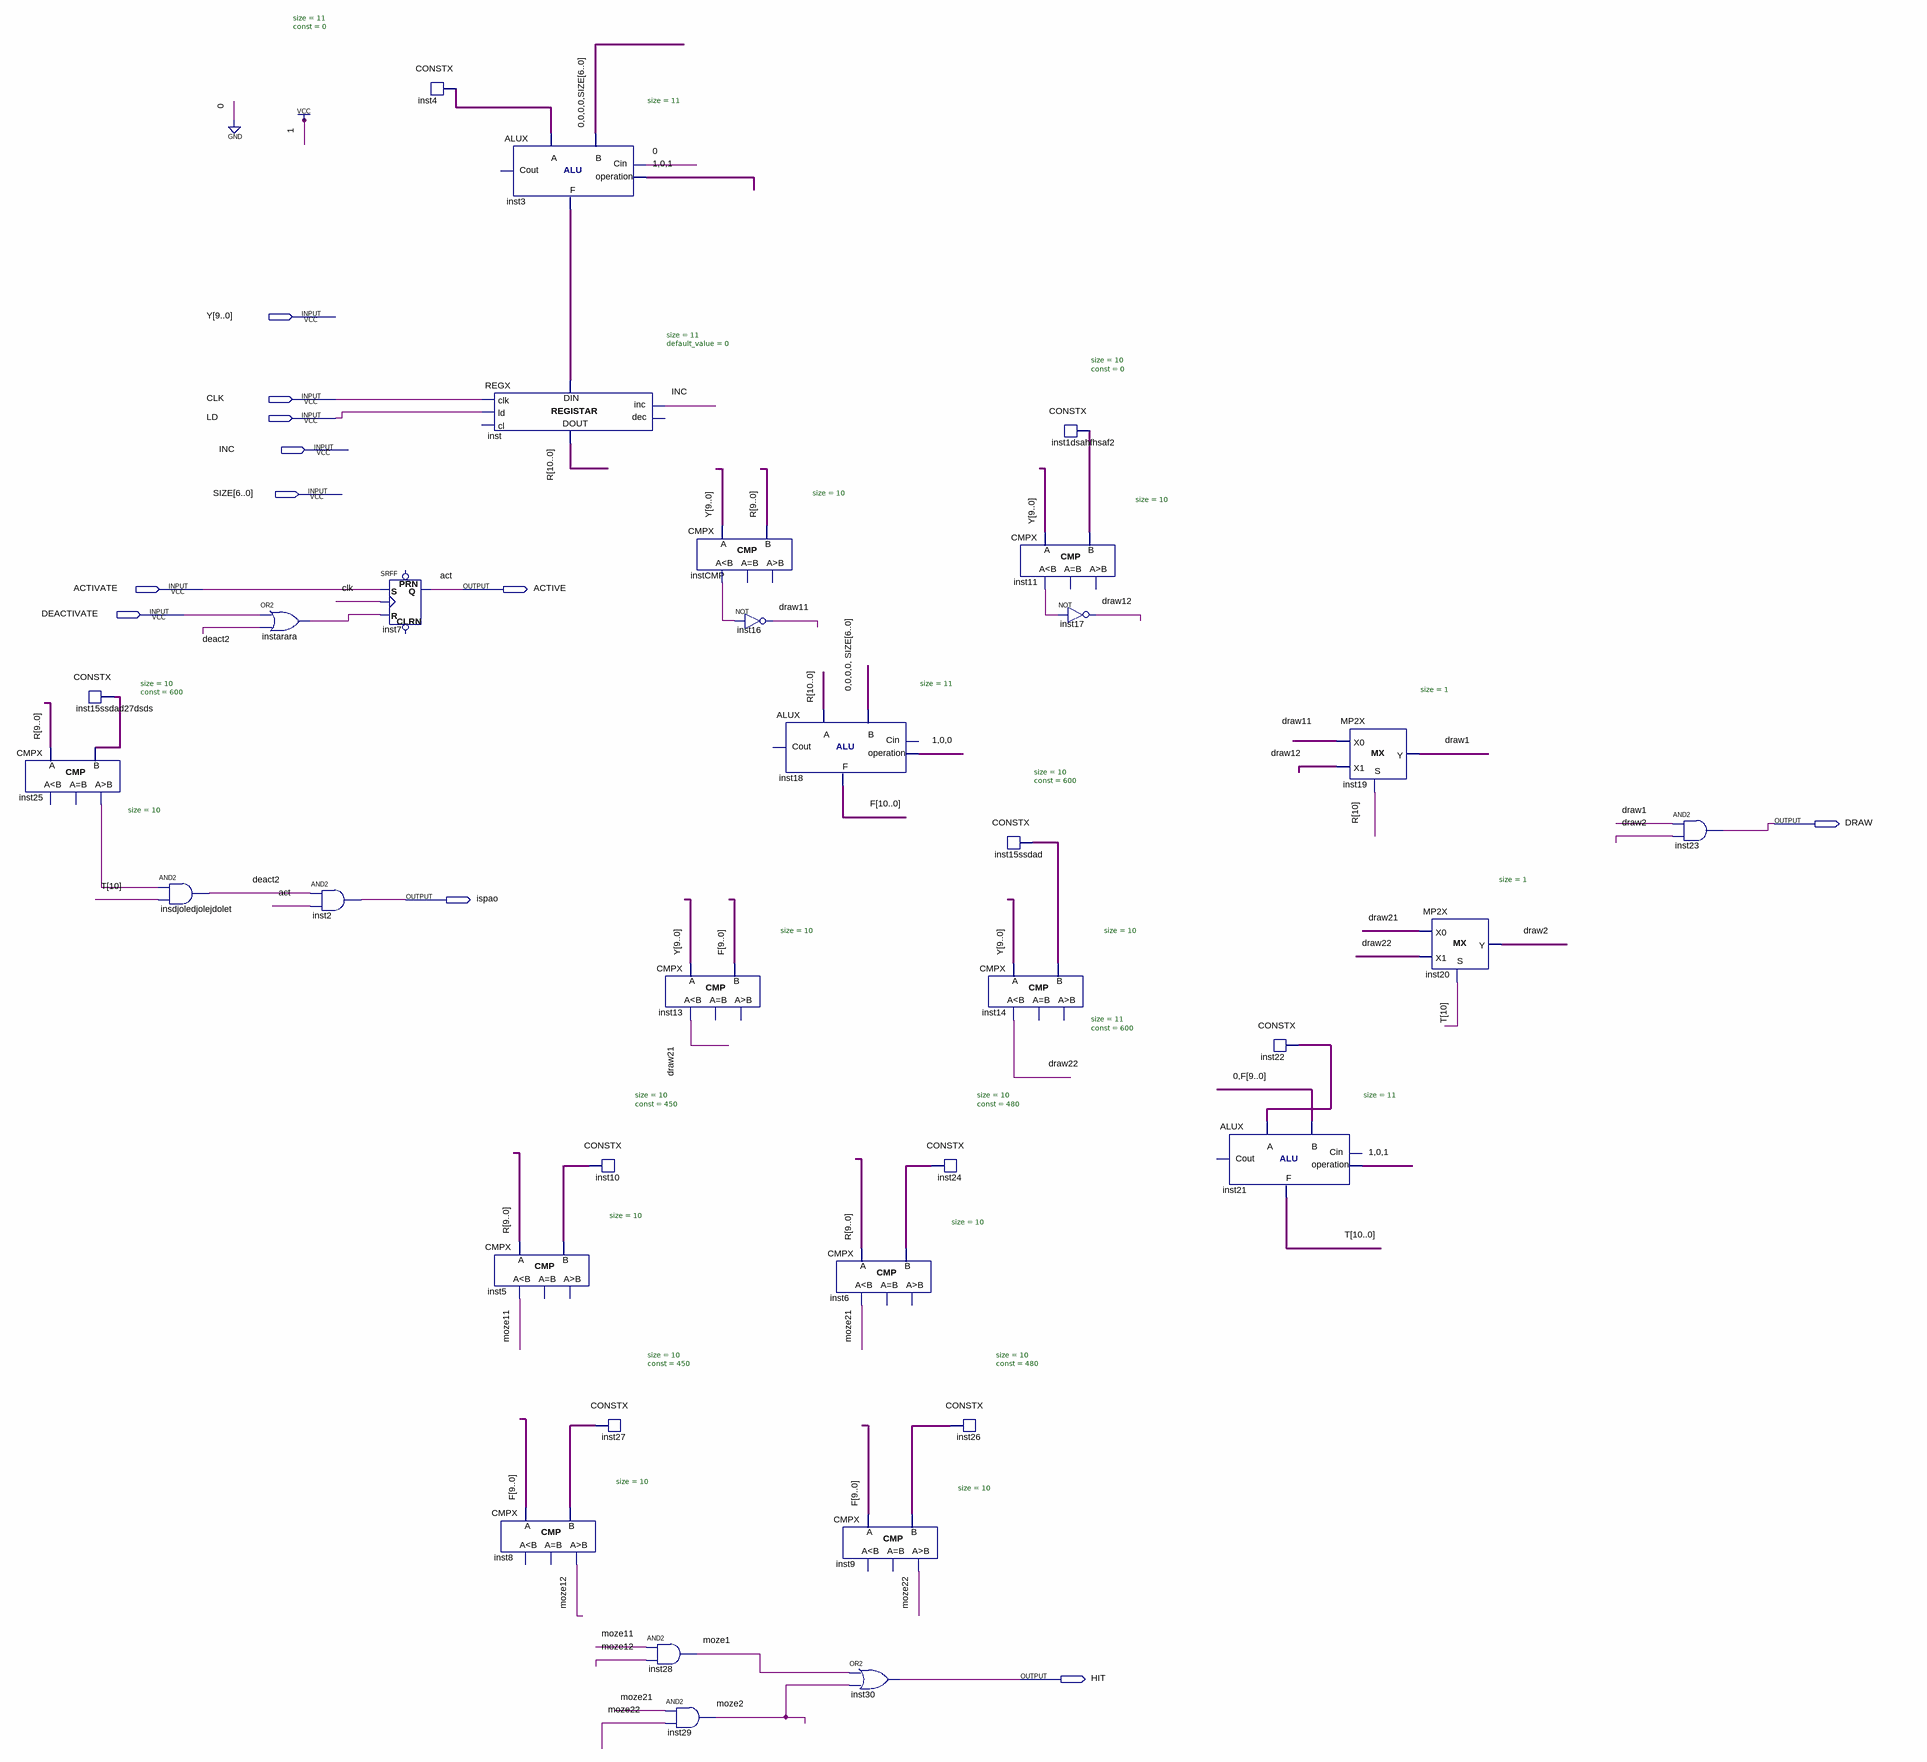
[diagram p0: schematic sheet]
// Quartus schematic pravougaonik.bdf as structural Verilog: 34 symbols, 11 pins
module pravougaonik (
  input  [9:0] Y,
  input  CLK,
  input  LD,
  input  INC,
  input  [6:0] SIZE,
  input  ACTIVATE,
  input  DEACTIVATE,
  output ACTIVE,
  output DRAW,
  output ispao,
  output HIT
);

  wire deact2, draw1, draw2, draw11, draw12, draw21, draw22, inst11_ls, inst25_gr, instarara_out, instCMP_ls,
       moze1, moze2, moze11, moze12, moze21, moze22;
  wire [9:0] inst1dsahfhsaf2_data, inst10_data, inst15ssdad27dsds_data, inst15ssdad_data, inst24_data,
       inst26_data, inst27_data;
  wire [10:0] F, inst3_f, inst4_data, inst22_data, R, T;

  CMPX #(.size(10)) inst25 (.A(R[9:0]), .B(inst15ssdad27dsds_data), .gr(inst25_gr));  // open: ls, eq
  CONSTX #(.size(10), .\const (600)) inst15ssdad27dsds (.data(inst15ssdad27dsds_data));
  and insdjoledjolejdolet (deact2, inst25_gr, T[10]);
  or instarara (instarara_out, DEACTIVATE, deact2);
  and inst2 (ispao, deact2, ACTIVE);
  SRFF inst7 (.S(ACTIVATE), .R(instarara_out), .CLK(CLK), .Q(ACTIVE));  // open: PRN, CLRN
  CONSTX #(.size(11), .\const (0)) inst4 (.data(inst4_data));
  ALUX #(.size(11)) inst3 (.Cin(1'b0), .B({4'b0000, SIZE}), .A(inst4_data), .op(3'b101), .F(inst3_f));  // open: Cout
  REGX #(.size(11), .default_value(0)) inst (
    .clk(CLK), .ld(LD), .inc(INC), .data_in(inst3_f), .data_out(R));  // open: cl, dec
  CMPX #(.size(10)) inst5 (.A(R[9:0]), .B(inst10_data), .ls(moze11));  // open: eq, gr
  CMPX #(.size(10)) inst8 (.A(F[9:0]), .B(inst27_data), .gr(moze12));  // open: ls, eq
  CONSTX #(.size(10), .\const (450)) inst10 (.data(inst10_data));
  CONSTX #(.size(10), .\const (450)) inst27 (.data(inst27_data));
  CMPX #(.size(10)) inst13 (.A(Y), .B(F[9:0]), .ls(draw21));  // open: eq, gr
  and inst28 (moze1, moze11, moze12);
  CMPX #(.size(10)) instCMP (.A(Y), .B(R[9:0]), .ls(instCMP_ls));  // open: eq, gr
  and inst29 (moze2, moze21, moze22);
  not inst16 (draw11, instCMP_ls);
  ALUX #(.size(11)) inst18 (.B({4'b0000, SIZE}), .A(R), .op(3'b100), .F(F));  // open: Cin, Cout
  CMPX #(.size(10)) inst6 (.A(R[9:0]), .B(inst24_data), .ls(moze21));  // open: eq, gr
  CMPX #(.size(10)) inst9 (.A(F[9:0]), .B(inst26_data), .gr(moze22));  // open: ls, eq
  or inst30 (HIT, moze1, moze2);
  CONSTX #(.size(10), .\const (480)) inst24 (.data(inst24_data));
  CONSTX #(.size(10), .\const (480)) inst26 (.data(inst26_data));
  CMPX #(.size(10)) inst11 (.A(Y), .B(inst1dsahfhsaf2_data), .ls(inst11_ls));  // open: eq, gr
  CONSTX #(.size(10), .\const (600)) inst15ssdad (.data(inst15ssdad_data));
  CMPX #(.size(10)) inst14 (.A(Y), .B(inst15ssdad_data), .ls(draw22));  // open: eq, gr
  CONSTX #(.size(10), .\const (0)) inst1dsahfhsaf2 (.data(inst1dsahfhsaf2_data));
  not inst17 (draw12, inst11_ls);
  CONSTX #(.size(11), .\const (600)) inst22 (.data(inst22_data));
  ALUX #(.size(11)) inst21 (.B({1'b0, F[9:0]}), .A(inst22_data), .op(3'b101), .F(T));  // open: Cin, Cout
  MP2X #(.size(1)) inst19 (.S(R[10]), .X0(draw11), .X1(draw12), .Y(draw1));
  MP2X #(.size(1)) inst20 (.S(T[10]), .X0(draw21), .X1(draw22), .Y(draw2));
  and inst23 (DRAW, draw1, draw2);

  // Other names for the same wires on the sheet: act = ACTIVE
endmodule
